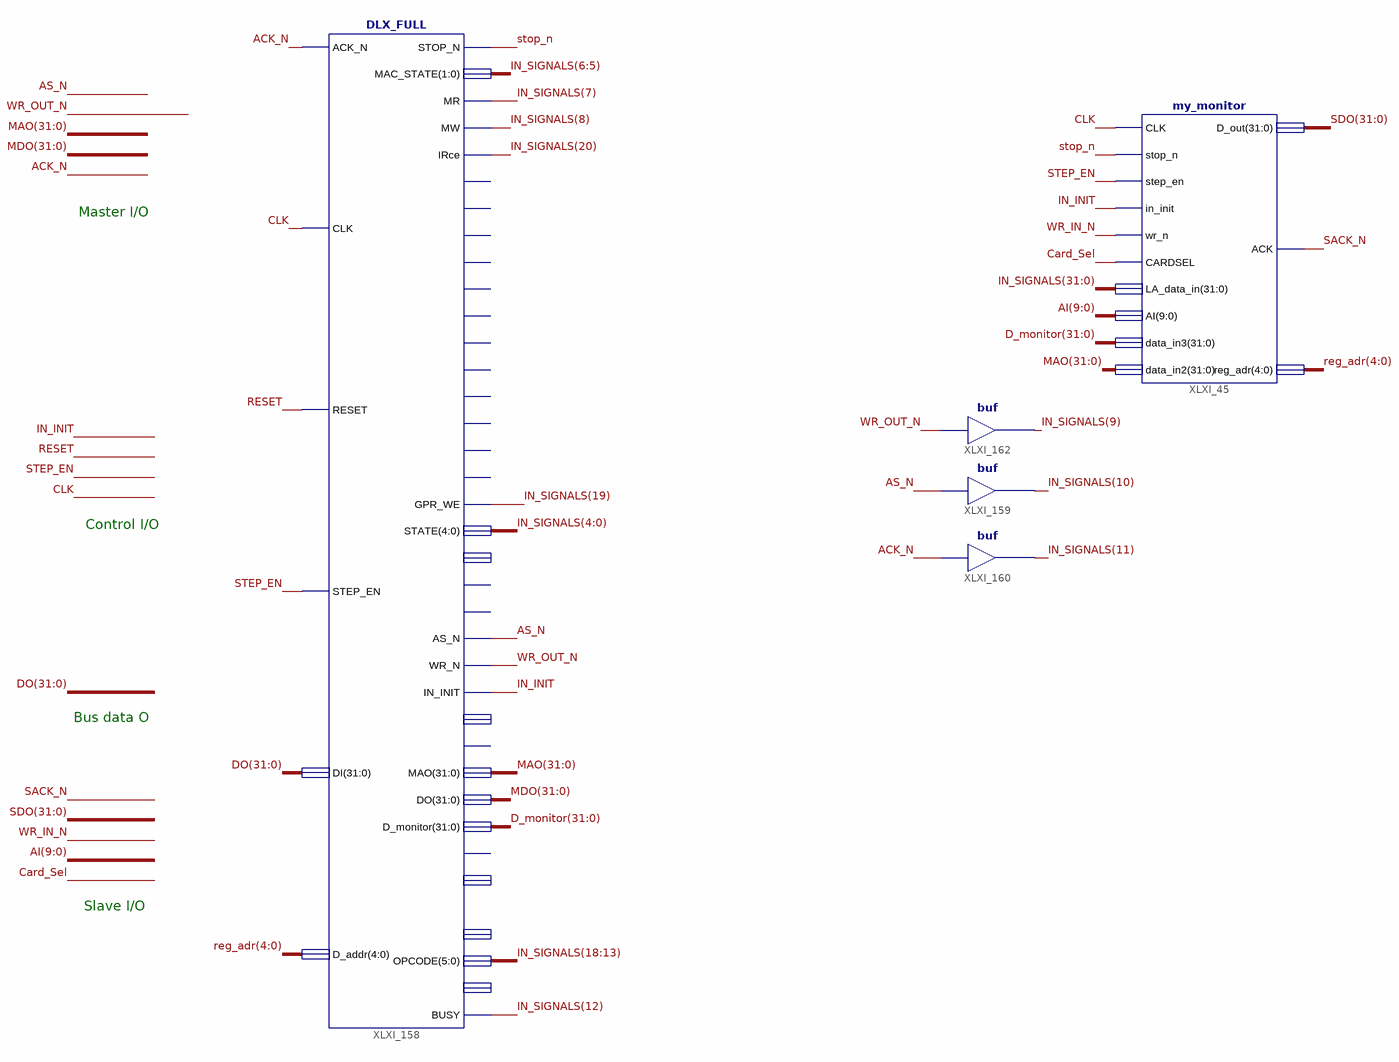
[diagram p0: schematic sheet 1]
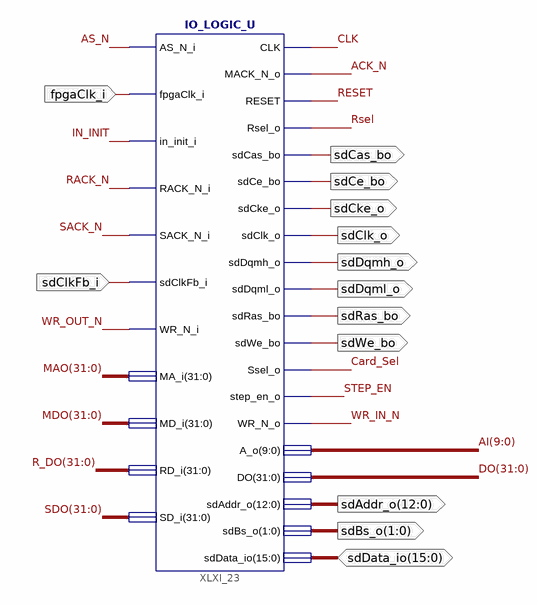
[diagram p1: schematic sheet 2]
// Xilinx ISE schematic Top_Level.sch (spartan6) as structural Verilog: 6 symbols, 13 ports
module Top_Level (
  input  fpgaClk_i,
  input  sdClkFb_i,
  inout  [15:0] sdData_io,
  output sdClk_o,
  output [1:0] sdBs_o,
  output sdDqml_o,
  output sdDqmh_o,
  output sdWe_bo,
  output sdCas_bo,
  output sdRas_bo,
  output sdCe_bo,
  output sdCke_o,
  output [12:0] sdAddr_o
);

  wire ACK_N, AS_N, Card_Sel, CLK, IN_INIT, RACK_N, RESET, Rsel, SACK_N, STEP_EN, stop_n, WR_IN_N, WR_OUT_N;
  wire [4:0] reg_adr;
  wire [9:0] AI;
  wire [31:0] D_monitor, DO, IN_SIGNALS, MAO, MDO, R_DO, SDO;

  IO_LOGIC_U XLXI_23 (
    .AS_N_i(AS_N), .fpgaClk_i(fpgaClk_i), .in_init_i(IN_INIT), .RACK_N_i(RACK_N), .SACK_N_i(SACK_N),
    .sdClkFb_i(sdClkFb_i), .WR_N_i(WR_OUT_N), .MA_i(MAO), .MD_i(MDO), .RD_i(R_DO), .SD_i(SDO), .CLK(CLK),
    .MACK_N_o(ACK_N), .RESET(RESET), .Rsel_o(Rsel), .sdCas_bo(sdCas_bo), .sdCe_bo(sdCe_bo),
    .sdCke_o(sdCke_o), .sdClk_o(sdClk_o), .sdDqmh_o(sdDqmh_o), .sdDqml_o(sdDqml_o), .sdRas_bo(sdRas_bo),
    .sdWe_bo(sdWe_bo), .Ssel_o(Card_Sel), .step_en_o(STEP_EN), .WR_N_o(WR_IN_N), .A_o(AI), .DO(DO),
    .sdAddr_o(sdAddr_o), .sdBs_o(sdBs_o), .sdData_io(sdData_io));
  my_monitor XLXI_45 (
    .CLK(CLK), .stop_n(stop_n), .step_en(STEP_EN), .in_init(IN_INIT), .wr_n(WR_IN_N), .CARDSEL(Card_Sel),
    .LA_data_in(IN_SIGNALS), .AI(AI), .data_in3(D_monitor), .data_in2(MAO), .D_out(SDO), .ACK(SACK_N),
    .reg_adr(reg_adr));
  DLX_FULL XLXI_158 (
    .ACK_N(ACK_N), .CLK(CLK), .RESET(RESET), .STEP_EN(STEP_EN), .DI(DO), .D_addr(reg_adr), .STOP_N(stop_n),
    .MAC_STATE(IN_SIGNALS[6:5]), .MR(IN_SIGNALS[7]), .MW(IN_SIGNALS[8]), .IRce(IN_SIGNALS[20]),
    .GPR_WE(IN_SIGNALS[19]), .STATE(IN_SIGNALS[4:0]), .AS_N(AS_N), .WR_N(WR_OUT_N), .IN_INIT(IN_INIT),
    .MAO(MAO), .DO(MDO), .D_monitor(D_monitor), .OPCODE(IN_SIGNALS[18:13]), .BUSY(IN_SIGNALS[12]));  // open: jlink, Ace, Bce, Cce, test, Itype, add, DINTsel, MARce, MDRce, MDRsel, Asel, S1sel, SHIFTen, SHIFTright, S2sel, PCce, AEQZ, PC, ALUF, IR
  buf XLXI_159 (IN_SIGNALS[10], AS_N);
  buf XLXI_160 (IN_SIGNALS[11], ACK_N);
  buf XLXI_162 (IN_SIGNALS[9], WR_OUT_N);

  // Notes on the sheet:
  //   Master I/O
  //   Control I/O
  //   Bus data O
  //   Slave I/O
endmodule
